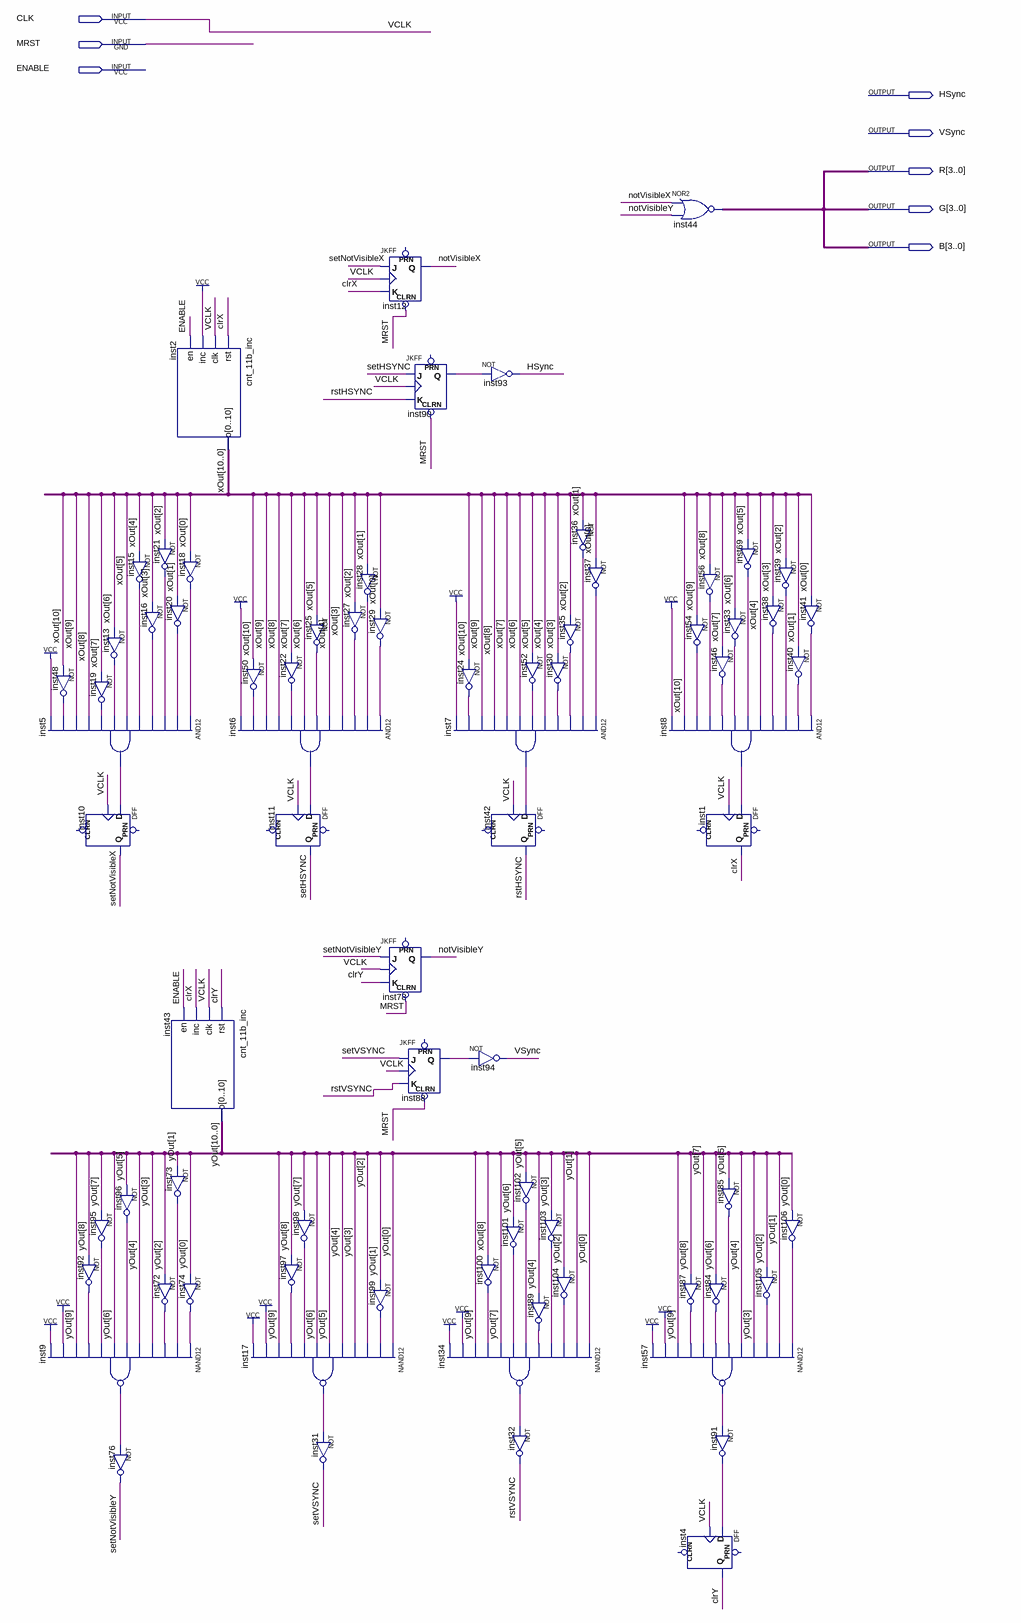
[diagram p0: schematic sheet]
// Quartus schematic VGAcontroller.bdf as structural Verilog: 75 symbols, 8 pins
module VGAcontroller (
  input  CLK,
  input  MRST,
  input  ENABLE,
  output HSync,
  output VSync,
  output [3:0] R,
  output [3:0] G,
  output [3:0] B
);

  wire clrX, clrY, inst5_out, inst6_out, inst7_out, inst8_out, inst9_out, inst13_out, inst15_out, inst16_out,
       inst17_out, inst18_out, inst19_out, inst20_out, inst21_out, inst22_out, inst24_out, inst25_out,
       inst27_out, inst28_out, inst29_out, inst30_out, inst33_out, inst34_out, inst35_out, inst36_out,
       inst37_out, inst38_out, inst39_out, inst40_out, inst41_out, inst46_out, inst48_out, inst50_out,
       inst52_out, inst54_out, inst56_out, inst57_out, inst69_out, inst72_out, inst73_out, inst74_out,
       inst84_out, inst85_out, inst87_out, inst88_q, inst89_out, inst90_q, inst91_out, inst92_out,
       inst95_out, inst96_out, inst97_out, inst98_out, inst99_out, inst100_out, inst101_out, inst102_out,
       inst103_out, inst104_out, inst105_out, inst106_out, notVisibleX, notVisibleY, rstHSYNC, rstVSYNC,
       setHSYNC, setNotVisibleX, setNotVisibleY, setVSYNC;
  wire [10:0] xOut, yOut;

  not inst48 (inst48_out, xOut[10]);
  and inst5 (inst5_out, inst18_out, inst20_out, inst21_out, inst16_out, inst15_out, xOut[5], inst13_out, inst19_out, xOut[8], xOut[9], inst48_out, 1'b1);
  DFF inst10 (.CLK(CLK), .D(inst5_out), .Q(setNotVisibleX));  // open: CLRN, PRN
  not inst92 (inst92_out, yOut[8]);
  nand inst9 (inst9_out, inst74_out, inst73_out, inst72_out, yOut[3], yOut[4], inst96_out, yOut[6], inst95_out, inst92_out, yOut[9], 1'b1, 1'b1);
  not inst15 (inst15_out, xOut[4]);
  not inst13 (inst13_out, xOut[6]);
  not inst19 (inst19_out, xOut[7]);
  not inst96 (inst96_out, yOut[5]);
  not inst95 (inst95_out, yOut[7]);
  not inst76 (setNotVisibleY, inst9_out);
  cnt_11b_inc inst2 (.rst(clrX), .clk(CLK), .inc(1'b1), .en(ENABLE), .o(xOut));
  not inst21 (inst21_out, xOut[2]);
  not inst18 (inst18_out, xOut[0]);
  not inst20 (inst20_out, xOut[1]);
  not inst16 (inst16_out, xOut[3]);
  cnt_11b_inc inst43 (.rst(clrY), .clk(CLK), .inc(clrX), .en(ENABLE), .o(yOut));
  not inst73 (inst73_out, yOut[1]);
  not inst72 (inst72_out, yOut[2]);
  not inst74 (inst74_out, yOut[0]);
  and inst6 (inst6_out, inst29_out, inst28_out, inst27_out, xOut[3], xOut[4], inst25_out, xOut[6], inst22_out, xOut[8], xOut[9], inst50_out, 1'b1);
  not inst22 (inst22_out, xOut[7]);
  not inst50 (inst50_out, xOut[10]);
  DFF inst11 (.CLK(CLK), .D(inst6_out), .Q(setHSYNC));  // open: CLRN, PRN
  not inst97 (inst97_out, yOut[8]);
  nand inst17 (inst17_out, yOut[0], inst99_out, yOut[2], yOut[3], yOut[4], yOut[5], yOut[6], inst98_out, inst97_out, yOut[9], 1'b1, 1'b1);
  not inst25 (inst25_out, xOut[5]);
  not inst98 (inst98_out, yOut[7]);
  not inst31 (setVSYNC, inst17_out);
  JKFF inst12 (.CLRN(MRST), .K(clrX), .J(setNotVisibleX), .CLK(CLK), .Q(notVisibleX));  // open: PRN
  not inst28 (inst28_out, xOut[1]);
  not inst27 (inst27_out, xOut[2]);
  not inst29 (inst29_out, xOut[0]);
  JKFF inst78 (.CLRN(MRST), .K(clrY), .J(setNotVisibleY), .CLK(CLK), .Q(notVisibleY));  // open: PRN
  not inst99 (inst99_out, yOut[1]);
  JKFF inst90 (.CLRN(MRST), .K(rstHSYNC), .J(setHSYNC), .CLK(CLK), .Q(inst90_q));  // open: PRN
  JKFF inst88 (.CLRN(MRST), .K(rstVSYNC), .J(setVSYNC), .CLK(CLK), .Q(inst88_q));  // open: PRN
  nand inst34 (inst34_out, yOut[0], yOut[1], inst104_out, inst103_out, inst89_out, inst102_out, inst101_out, yOut[7], inst100_out, yOut[9], 1'b1, 1'b1);
  not inst93 (HSync, inst90_q);
  not inst24 (inst24_out, xOut[10]);
  and inst7 (inst7_out, inst37_out, inst36_out, inst35_out, inst30_out, xOut[4], inst52_out, xOut[6], xOut[7], xOut[8], xOut[9], inst24_out, 1'b1);
  DFF inst42 (.CLK(CLK), .D(inst7_out), .Q(rstHSYNC));  // open: CLRN, PRN
  not inst94 (VSync, inst88_q);
  not inst100 (inst100_out, xOut[8]);
  not inst52 (inst52_out, xOut[5]);
  not inst102 (inst102_out, yOut[5]);
  not inst103 (inst103_out, yOut[3]);
  not inst101 (inst101_out, yOut[6]);
  not inst89 (inst89_out, yOut[4]);
  not inst32 (rstVSYNC, inst34_out);
  not inst36 (inst36_out, xOut[1]);
  not inst37 (inst37_out, xOut[0]);
  not inst35 (inst35_out, xOut[2]);
  not inst30 (inst30_out, xOut[3]);
  not inst104 (inst104_out, yOut[2]);
  nand inst57 (inst57_out, inst106_out, yOut[1], inst105_out, yOut[3], yOut[4], inst85_out, inst84_out, yOut[7], inst87_out, yOut[9], 1'b1, 1'b1);
  assign B = ~({4{notVisibleX}} | {4{notVisibleY}});  // NOR2 inst44, 4 bits wide
  not inst54 (inst54_out, xOut[9]);
  and inst8 (inst8_out, inst41_out, inst40_out, inst39_out, inst38_out, xOut[4], inst69_out, inst33_out, inst46_out, inst56_out, inst54_out, xOut[10], 1'b1);
  not inst87 (inst87_out, yOut[8]);
  DFF inst4 (.CLK(CLK), .D(inst91_out), .Q(clrY));  // open: CLRN, PRN
  not inst69 (inst69_out, xOut[5]);
  not inst56 (inst56_out, xOut[8]);
  not inst33 (inst33_out, xOut[6]);
  not inst46 (inst46_out, xOut[7]);
  DFF inst1 (.CLK(CLK), .D(inst8_out), .Q(clrX));  // open: CLRN, PRN
  not inst85 (inst85_out, yOut[5]);
  not inst84 (inst84_out, yOut[6]);
  not inst91 (inst91_out, inst57_out);
  not inst39 (inst39_out, xOut[2]);
  not inst38 (inst38_out, xOut[3]);
  not inst40 (inst40_out, xOut[1]);
  not inst106 (inst106_out, yOut[0]);
  not inst105 (inst105_out, yOut[2]);
  not inst41 (inst41_out, xOut[0]);

  assign G = B;
  assign R = B;

  // Other names for the same wires on the sheet: VCLK = CLK
endmodule
